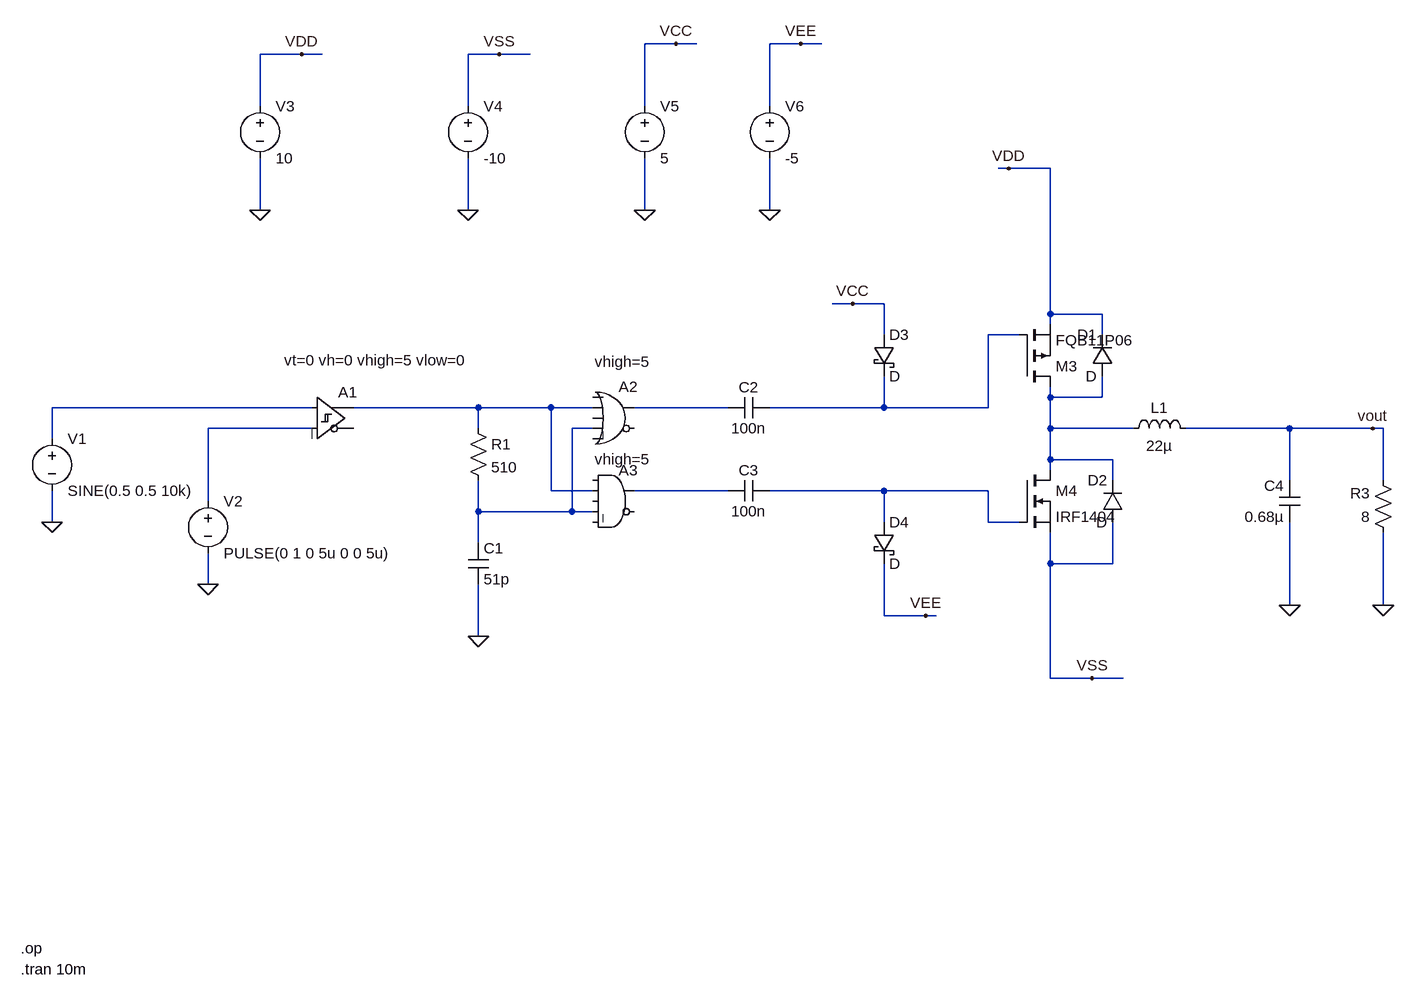
[diagram p0: schematic ClassDAmplifierHalfBridge.asc]
ClassDAmplifierHalfBridge.asc, the LTspice schematic file:
Version 4
SHEET 1 1636 1408
WIRE 80 -96 32 -96
WIRE 112 -96 80 -96
WIRE 272 -96 224 -96
WIRE 304 -96 272 -96
WIRE -496 -80 -560 -80
WIRE -464 -80 -496 -80
WIRE -192 -80 -240 -80
WIRE -144 -80 -192 -80
WIRE -560 0 -560 -80
WIRE -240 0 -240 -80
WIRE 32 0 32 -96
WIRE 224 0 224 -96
WIRE 592 96 576 96
WIRE 656 96 592 96
WIRE -560 160 -560 80
WIRE -240 160 -240 80
WIRE 32 160 32 80
WIRE 224 160 224 80
WIRE 352 304 320 304
WIRE 400 304 352 304
WIRE 656 320 656 96
WIRE 736 320 656 320
WIRE 656 336 656 320
WIRE 400 352 400 304
WIRE 608 352 560 352
WIRE 736 352 736 320
WIRE 656 448 656 432
WIRE 736 448 736 416
WIRE 736 448 656 448
WIRE -480 464 -880 464
WIRE -224 464 -416 464
WIRE -112 464 -224 464
WIRE -48 464 -112 464
WIRE 160 464 16 464
WIRE 400 464 400 416
WIRE 400 464 224 464
WIRE 560 464 560 352
WIRE 560 464 400 464
WIRE -480 496 -640 496
WIRE -224 496 -224 464
WIRE -48 496 -80 496
WIRE 656 496 656 448
WIRE 784 496 656 496
WIRE 1024 496 864 496
WIRE 1152 496 1024 496
WIRE 1168 496 1152 496
WIRE -880 512 -880 464
WIRE 656 544 656 496
WIRE 752 544 656 544
WIRE 656 560 656 544
WIRE 752 576 752 544
WIRE 1024 576 1024 496
WIRE 1168 576 1168 496
WIRE -112 592 -112 464
WIRE -48 592 -112 592
WIRE 160 592 16 592
WIRE 400 592 224 592
WIRE 560 592 400 592
WIRE -640 608 -640 496
WIRE -224 624 -224 576
WIRE -80 624 -80 496
WIRE -80 624 -224 624
WIRE -48 624 -80 624
WIRE -880 640 -880 592
WIRE 400 640 400 592
WIRE 560 640 560 592
WIRE 608 640 560 640
WIRE -224 672 -224 624
WIRE 656 704 656 656
WIRE 752 704 752 640
WIRE 752 704 656 704
WIRE -640 736 -640 688
WIRE 1024 768 1024 640
WIRE 1168 768 1168 656
WIRE 400 784 400 704
WIRE 464 784 400 784
WIRE 480 784 464 784
WIRE -224 816 -224 736
WIRE 656 880 656 704
WIRE 720 880 656 880
WIRE 768 880 720 880
FLAG -640 736 0
FLAG -880 640 0
FLAG -224 816 0
FLAG -560 160 0
FLAG 1168 768 0
FLAG 1024 768 0
FLAG 1152 496 vout
FLAG 592 96 VDD
FLAG -496 -80 VDD
FLAG -240 160 0
FLAG -192 -80 VSS
FLAG 720 880 VSS
FLAG 32 160 0
FLAG 224 160 0
FLAG 80 -96 VCC
FLAG 272 -96 VEE
FLAG 464 784 VEE
FLAG 352 304 VCC
SYMBOL Digital\\diffschmitt -480 416 R0
WINDOW 3 -43 -25 Left 2
SYMATTR Value vt=0 vh=0 vhigh=5 vlow=0
SYMATTR InstName A1
SYMBOL voltage -880 496 R0
WINDOW 123 0 0 Left 0
WINDOW 39 0 0 Left 0
SYMATTR InstName V1
SYMATTR Value SINE(0.5 0.5 10k)
SYMBOL voltage -640 592 R0
WINDOW 123 0 0 Left 0
WINDOW 39 0 0 Left 0
SYMATTR InstName V2
SYMATTR Value PULSE(0 1 0 5u 0 0 5u)
SYMBOL Digital\\or -16 416 R0
WINDOW 3 -29 -23 Left 2
SYMATTR Value vhigh=5
SYMATTR InstName A2
SYMBOL Digital\\and -16 544 R0
WINDOW 3 -29 -1 Left 2
SYMATTR Value vhigh=5
SYMATTR InstName A3
SYMBOL res -240 480 R0
SYMATTR InstName R1
SYMATTR Value 510
SYMBOL cap -240 672 R0
SYMATTR InstName C1
SYMATTR Value 51p
SYMBOL cap 224 448 R90
WINDOW 0 0 32 VBottom 2
WINDOW 3 32 32 VTop 2
SYMATTR InstName C2
SYMATTR Value 100n
SYMBOL cap 224 576 R90
WINDOW 0 0 32 VBottom 2
WINDOW 3 32 32 VTop 2
SYMATTR InstName C3
SYMATTR Value 100n
SYMBOL ind 768 512 R270
WINDOW 0 32 56 VTop 2
WINDOW 3 5 56 VBottom 2
SYMATTR InstName L1
SYMATTR Value 22µ
SYMBOL cap 1040 640 R180
WINDOW 0 24 56 Left 2
WINDOW 3 24 8 Left 2
SYMATTR InstName C4
SYMATTR Value 0.68µ
SYMBOL res 1184 672 R180
WINDOW 0 36 76 Left 2
WINDOW 3 36 40 Left 2
SYMATTR InstName R3
SYMATTR Value 8
SYMBOL voltage -560 -16 R0
WINDOW 123 0 0 Left 0
WINDOW 39 0 0 Left 0
SYMATTR InstName V3
SYMATTR Value 10
SYMBOL diode 752 416 R180
WINDOW 0 24 64 Left 2
WINDOW 3 24 0 Left 2
SYMATTR InstName D1
SYMBOL diode 768 640 R180
WINDOW 0 24 64 Left 2
WINDOW 3 24 0 Left 2
SYMATTR InstName D2
SYMBOL voltage -240 -16 R0
WINDOW 123 0 0 Left 0
WINDOW 39 0 0 Left 0
SYMATTR InstName V4
SYMATTR Value -10
SYMBOL schottky 384 352 R0
SYMATTR InstName D3
SYMBOL schottky 384 640 R0
SYMATTR InstName D4
SYMBOL voltage 32 -16 R0
WINDOW 123 0 0 Left 0
WINDOW 39 0 0 Left 0
SYMATTR InstName V5
SYMATTR Value 5
SYMBOL voltage 224 -16 R0
WINDOW 123 0 0 Left 0
WINDOW 39 0 0 Left 0
SYMATTR InstName V6
SYMATTR Value -5
SYMBOL pmos 608 432 M180
SYMATTR InstName M3
SYMATTR Value FQB11P06
SYMBOL nmos 608 560 R0
SYMATTR InstName M4
SYMATTR Value IRF1404
TEXT -928 1328 Left 2 !.tran 10m
TEXT -928 1296 Left 2 !.op

The netlist it stands for:
* ClassDAmplifierHalfBridge.asc
A1 N003 N006 0 0 0 0 N004 0 SCHMITT vt=0 vh=0 vhigh=5 vlow=0
V1 N003 0 SINE(0.5 0.5 10k)
V2 N006 0 PULSE(0 1 0 5u 0 0 5u)
A2 0 N004 0 N007 0 0 N005 0 OR vhigh=5
A3 0 N004 0 N007 0 0 N008 0 AND vhigh=5
R1 N004 N007 510
C1 N007 0 51p
C2 N001 N005 100n
C3 N009 N008 100n
L1 N002 vout 22µ
C4 0 vout 0.68µ
R3 0 vout 8
V3 VDD 0 10
D1 N002 VDD D
D2 VSS N002 D
V4 VSS 0 -10
D3 VCC N001 D
D4 N009 VEE D
V5 VCC 0 5
V6 VEE 0 -5
M3 N002 N001 VDD VDD FQB11P06
M4 N002 N009 VSS VSS IRF1404
.model D D
.lib standard.dio
.model NMOS NMOS
.model PMOS PMOS
.lib standard.mos
.tran 10m
.op
.backanno
.end